# EAGLE design smart_lamp (EAGLE 9.6.2)
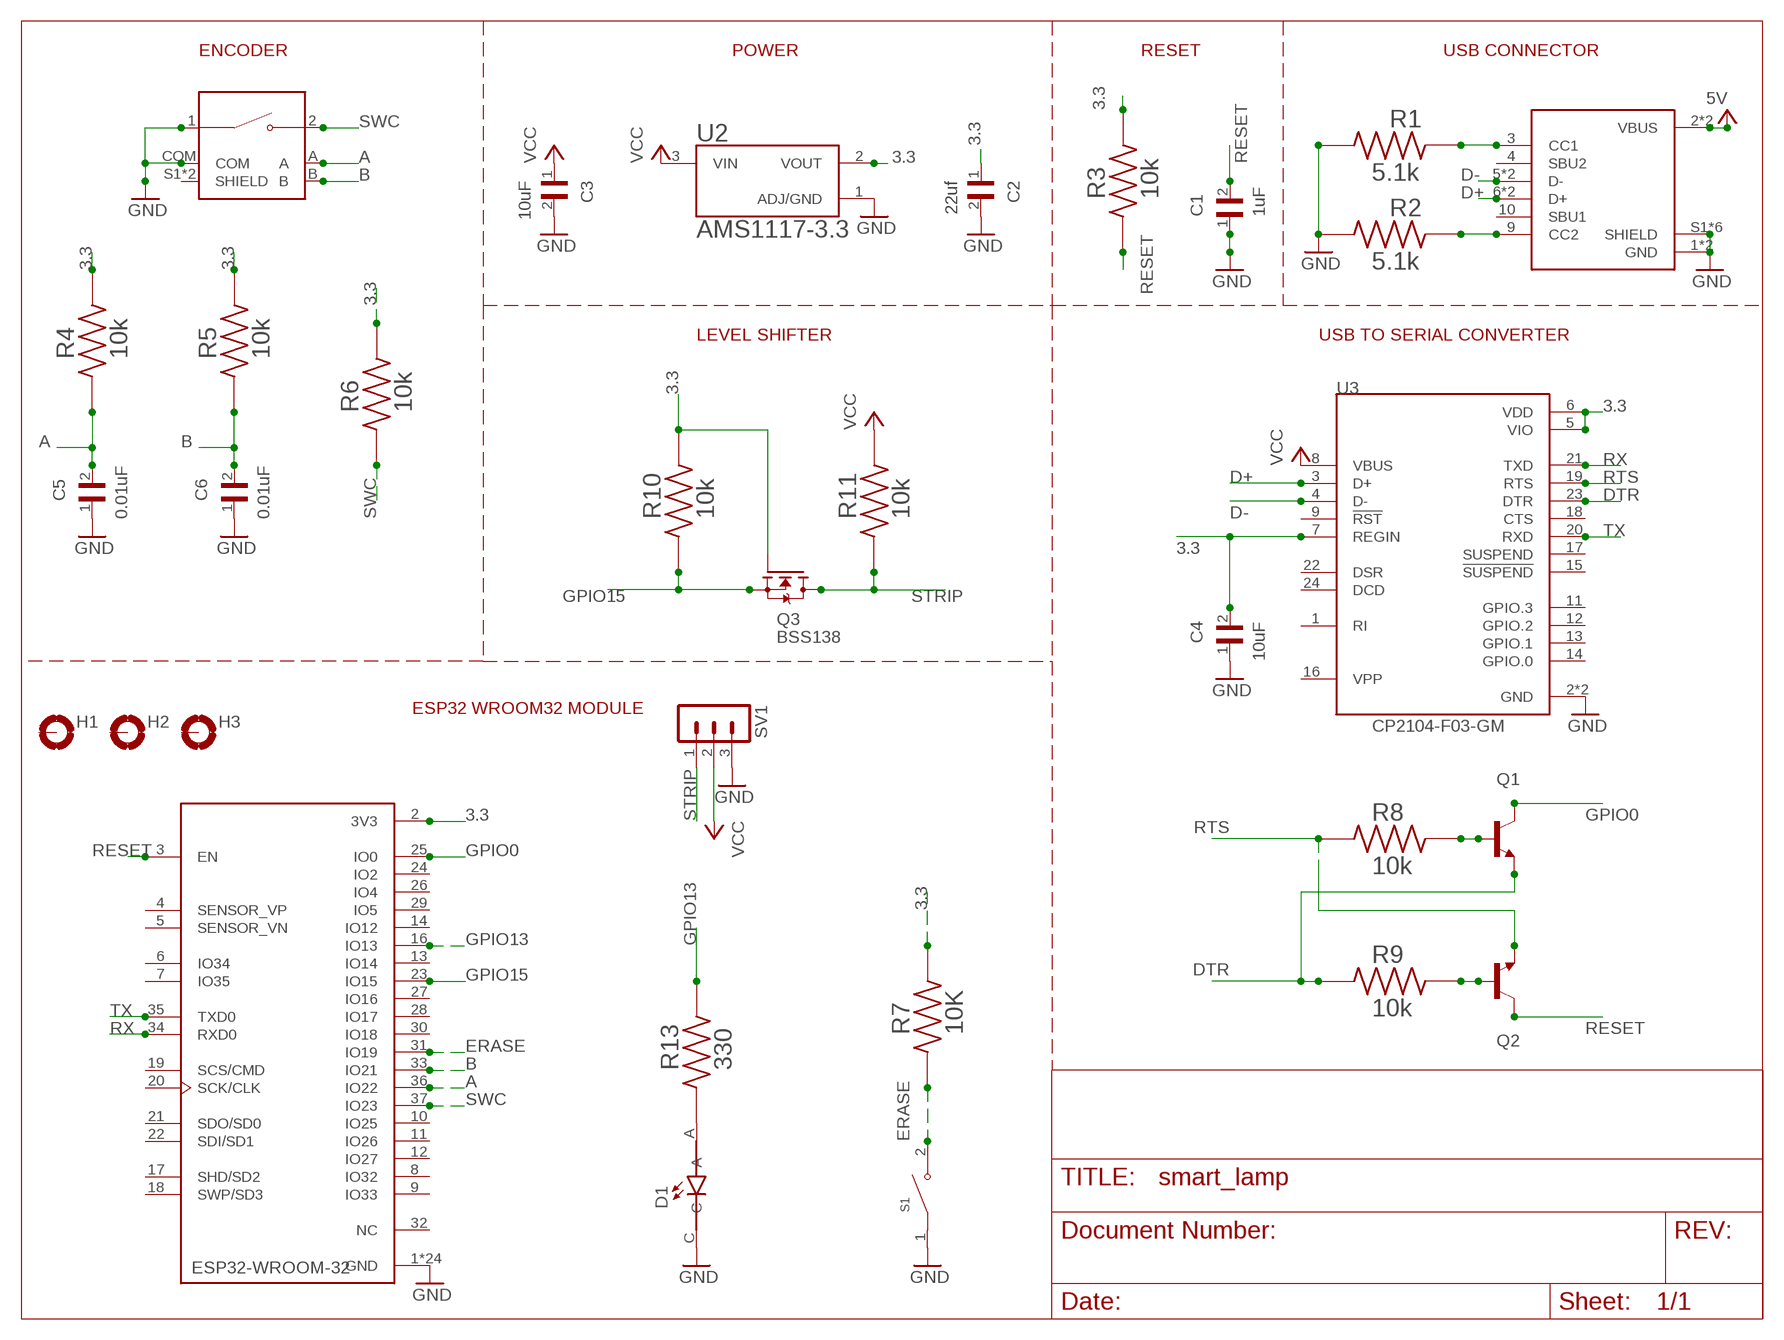
[diagram p0: schematic, sheet 1]

## Parts
C1  1uF  0805YC103J4T2A  [CAPC2012X94N]
C2  22uf  0805YC103J4T2A  [CAPC2012X94N]
C3  10uF  0805YC103J4T2A  [CAPC2012X94N]
C4  10uF  0805YC103J4T2A  [CAPC2012X94N]
C5  0.01uF  0805YC103J4T2A  [CAPC2012X94N]
C6  0.01uF  0805YC103J4T2A  [CAPC2012X94N]
D1  SML-LXT0805IW-TR  [LEDC2012X120N]
H1  MOUNT-PAD-ROUND3.2  [3,2-PAD]
H2  MOUNT-PAD-ROUND3.2  [3,2-PAD]
H3  MOUNT-PAD-ROUND3.2  [3,2-PAD]
J1  DX07S016JA1R1500  [JAE_DX07S016JA1R1500]
MT1  PEC11R-4215F-S0024  [XDCR_PEC11R-4215F-S0024]
Q1  MMBT2222  [SOT23-BEC]
Q2  MMBT2222  [SOT23-BEC]
Q3  BSS138  [SOT95P240X111-3N]
R1  5.1k  RC0805FR-07330RL  [RESC2012X60N]
R2  5.1k  RC0805FR-07330RL  [RESC2012X60N]
R3  10k  RC0805FR-07330RL  [RESC2012X60N]
R4  10k  RC0805FR-07330RL  [RESC2012X60N]
R5  10k  RC0805FR-07330RL  [RESC2012X60N]
R6  10k  RC0805FR-07330RL  [RESC2012X60N]
R7  10K  RC0805FR-07330RL  [RESC2012X60N]
R8  10k  RC0805FR-07330RL  [RESC2012X60N]
R9  10k  RC0805FR-07330RL  [RESC2012X60N]
R10  10k  RC0805FR-07330RL  [RESC2012X60N]
R11  10k  RC0805FR-07330RL  [RESC2012X60N]
R13  330  RC0805FR-07330RL  [RESC2012X60N]
S1  PTS636_SM43J_SMTR_LFS  [SW_PTS636_SM43J_SMTR_LFS]
SV1  MA03-1  [MA03-1]
U1  ESP32-WROOM-32  [MODULE_ESP32-WROOM-32]
U2  AMS1117-3.3  [SOT229P700X180-4N]
U3  CP2104-F03-GM  [QFN50P400X400X80-25N]

## Nets
3.3: C2.1 C4.2 Q3.1(G) R3.2 R4.2 R5.2 R6.2 R7.2 R10.2 U1.2(3V3) U2.2(VOUT) U3.5(VIO) U3.6(VDD) U3.7(REGIN)
A: C5.2 MT1.A R4.1 U1.36(IO22)
B: C6.2 MT1.B R5.1 U1.33(IO21)
D+: J1.6(D+) J1.7(D+) U3.3(D+)
D-: J1.5(D-) J1.8(D-) U3.4(D-)
DTR: Q1.E R9.1 U3.23(DTR)
ERASE: R7.1 S1.2(NO) U1.31(IO19)
GND: C1.1 C2.2 C3.2 C4.1 C5.1 C6.1 D1.C J1.1(GND) J1.12(GND) J1.S1(SHIELD) J1.S2(SHIELD) J1.S3(SHIELD) J1.S4(SHIELD) J1.S5(SHIELD) J1.S6(SHIELD) MT1.1 MT1.COM R1.1 R2.1 S1.1(COM) SV1.3 U1.1(GND) U1.15(GND) U1.38(GND) U1.39_1(GND) U1.39_2(GND) U1.39_3(GND) U1.39_4(GND) U1.39_5(GND) U1.39_6(GND) U1.39_7(GND) U1.39_8(GND) U1.39_9(GND) U1.39_10(GND) U1.39_11(GND) U1.39_12(GND) U1.39_13(GND) U1.39_14(GND) U1.39_15(GND) U1.39_16(GND) U1.39_17(GND) U1.39_18(GND) U1.39_19(GND) U1.39_20(GND) U1.39_21(GND) U2.1(ADJ/GND) U3.2(GND) U3.25(GND)
GPIO0: Q1.C U1.25(IO0)
GPIO13: R13.2 U1.16(IO13)
GPIO15: Q3.2(S) R10.1 U1.23(IO15)
N$1: J1.3(CC1) R1.2
N$2: J1.9(CC2) R2.2
N$3: Q1.B R8.2
N$4: Q2.B R9.2
N$5: D1.A R13.1
RESET: C1.2 Q2.C R3.1 U1.3(EN)
RTS: Q2.E R8.1 U3.19(RTS)
RX: U1.34(RXD0) U3.21(TXD)
STRIP: Q3.3(D) R11.1 SV1.1
SWC: MT1.2 R6.1 U1.37(IO23)
TX: U1.35(TXD0) U3.20(RXD)
VCC: C3.1 J1.2(VBUS) J1.11(VBUS) R11.2 SV1.2 U2.3(VIN) U3.8(VBUS) ; supply symbol labelled 5V
Unconnected: H1.B3,2(MOUNT) H2.B3,2(MOUNT) H3.B3,2(MOUNT) J1.4(SBU2) J1.10(SBU1) MT1.S1(SHIELD) MT1.S2(SHIELD) U1.4(SENSOR_VP) U1.5(SENSOR_VN) U1.6(IO34) U1.7(IO35) U1.8(IO32) U1.9(IO33) U1.10(IO25) U1.11(IO26) U1.12(IO27) U1.13(IO14) U1.14(IO12) U1.17(SHD/SD2) U1.18(SWP/SD3) U1.19(SCS/CMD) U1.20(SCK/CLK) U1.21(SDO/SD0) U1.22(SDI/SD1) U1.24(IO2) U1.26(IO4) U1.27(IO16) U1.28(IO17) U1.29(IO5) U1.30(IO18) U1.32(NC) U3.1(RI) U3.9(!RST) U3.11(GPIO.3) U3.12(GPIO.2) U3.13(GPIO.1) U3.14(GPIO.0) U3.15(!SUSPEND) U3.16(VPP) U3.17(SUSPEND) U3.18(CTS) U3.22(DSR) U3.24(DCD)

## Notes on the sheet
- ENCODER | POWER | RESET | USB CONNECTOR
- LEVEL SHIFTER | USB TO SERIAL CONVERTER
- ESP32 WROOM32 MODULE

## Library data of the parts
C1-C6 = 0805YC103J4T2A:0805YC103J4T2A: Cap Ceramic 0.01uF 16V X7R 5% SMD 0805 125°C Paper T/R Check availability <https://pricing.snapeda.com/parts/0805YC103J4T2A/AVX/view-part?ref=eda>; AVAILABILITY: In Stock; DESCRIPTION: 10000 pF ±5% 16V Ceramic Capacitor X7R 0805 (2012 Metric); MF: AVX; MP: 0805YC103J4T2A; PACKAGE: 2012 AVX; PRICE: None; PURCHASE-URL: https://pricing.snapeda.com/search/part/0805YC103J4T2A/?ref=eda
D1 = SML-LXT0805IW-TR:SML-LXT0805IW-TR: LED; Luminous Intensity:11µcd; Viewing Angle:140°; Forward Current:30mA; Forward Voltage:2V; Color:Red; LED Color:Red; Leaded Process Compatible:Yes; Lens Color:White; Mounting Type:Surface Mount ;RoHS Compliant: Yes Check availability <https://pricing.snapeda.com/parts/SML-LXT0805IW-TR/Lumex%20Opto/Components/view-part?ref=eda>; AVAILABILITY: In Stock; DESCRIPTION: Red - LED Indication - Discrete 2V 0805 (2012 Metric); MF: Lumex Opto/Components; MP: SML-LXT0805IW-TR; PACKAGE: 0805 Lumex; PRICE: None; PURCHASE-URL: https://pricing.snapeda.com/search/part/SML-LXT0805IW-TR/?ref=eda
H1-H3 = holes:MOUNT-PAD-ROUND: MOUNTING PAD, round
J1 = DX07S016JA1R1500:DX07S016JA1R1500: USB-C (USB TYPE-C) USB 2.0 Receptacle Connector 24 (16+8 Dummy) Position Surface Mount, Right Angle; Through Hole Check availability <https://pricing.snapeda.com/parts/DX07S016JA1R1500/JAE%20Electronics/view-part?ref=eda>; AVAILABILITY: In Stock; DESCRIPTION: USB-C (USB TYPE-C) USB 2.0 Receptacle Connector 24 (16+8 Dummy) Position Surface Mount, Right Angle; Through Hole; MF: JAE Electronics; MP: DX07S016JA1R1500; PACKAGE: None; PRICE: None; PURCHASE-URL: https://pricing.snapeda.com/search/part/DX07S016JA1R1500/?ref=eda
MT1 = PEC11R-4215F-S0024:PEC11R-4215F-S0024: Incremental Encoder, 12 Mm, Contact Rating 10 Ma - 5 Vdc Check availability <https://pricing.snapeda.com/parts/PEC11R-4215F-S0024/Bourns/view-part?ref=eda>; AVAILABILITY: In Stock; DESCRIPTION: Rotary Encoder Mechanical 24 Quadrature (Incremental) Vertical; MF: Bourns; MP: PEC11R-4215F-S0024; PACKAGE: None; PRICE: None; PURCHASE-URL: https://pricing.snapeda.com/search/part/PEC11R-4215F-S0024/?ref=eda
Q1 Q2 = MMBT2222_:MMBT2222*: NPN Transistor Check availability <https://pricing.snapeda.com/parts/MMBT2222/ON%20Semiconductor/view-part?ref=eda>; AVAILABILITY: In Stock; DESCRIPTION: Bipolar (BJT) Transistor NPN 30 V 600 mA 250MHz 300 mW Surface Mount SOT-23-3 (TO-236); MF: ON Semiconductor; MP: MMBT2222; PACKAGE: SOT-23-3 Fairchild Semiconductor; PRICE: None; PURCHASE-URL: https://pricing.snapeda.com/search/part/MMBT2222/?ref=eda
Q3 = BSS138:BSS138: N-Channel 50V 220mA (Ta) 360mW (Ta) Surface Mount SOT-23-3 Check availability <https://pricing.snapeda.com/parts/BSS138/ON%20Semiconductor/view-part?ref=eda>; AVAILABILITY: In Stock; DESCRIPTION: N-Channel 50 V 200mA (Ta) 225mW (Ta) Surface Mount SOT-23-3 (TO-236); MF: ON Semiconductor; MP: BSS138; PACKAGE: SOT-23 ON; PRICE: None; PURCHASE-URL: https://pricing.snapeda.com/search/part/BSS138/?ref=eda
R1-R11 R13 = RC0805FR-07330RL:RC0805FR-07330RL: Resistor SMD [YAGEO] RC0805FR-07330RL Resistor SMD Check availability <https://pricing.snapeda.com/parts/RC0805FR-07330RL/Yageo/view-part?ref=eda>; AVAILABILITY: In Stock; DESCRIPTION: 330 Ohms ±1% 0.125W, 1/8W Chip Resistor 0805 (2012 Metric) Moisture Resistant Thick Film; MF: Yageo; MP: RC0805FR-07330RL; PACKAGE: 2012 Rohm Semiconductor; PRICE: None; PURCHASE-URL: https://pricing.snapeda.com/search/part/RC0805FR-07330RL/?ref=eda
S1 = PTS636_SM43J_SMTR_LFS:PTS636_SM43J_SMTR_LFS: Tactile Switch SPST-NO Top Actuated Surface Mount Check availability <https://pricing.snapeda.com/parts/PTS636%20SM43J%20SMTR%20LFS/C%26K/view-part?ref=eda>; AVAILABILITY: In Stock; DESCRIPTION: Tactile Switch SPST-NO Top Actuated Surface Mount; MF: C&K; MP: PTS636 SM43J SMTR LFS; PACKAGE: None; PRICE: None; PURCHASE-URL: https://pricing.snapeda.com/search/part/PTS636 SM43J SMTR LFS/?ref=eda
SV1 = con-lstb:MA03-1: PIN HEADER; OC_FARNELL: unknown; OC_NEWARK: unknown
U1 = ESP32-WROOM-32:ESP32-WROOM-32: Check availability <https://pricing.snapeda.com/parts/ESP32-WROOM-32/Espressif%20Systems/view-part?ref=eda>; AVAILABILITY: In Stock; DESCRIPTION: Bluetooth, WiFi 802.11b/g/n, Bluetooth v4.2 +EDR, Class 1, 2 and 3 Transceiver Module 2.4GHz ~ 2.5GHz Antenna Not Included, U.FL Surface Mount; MF: Espressif Systems; MP: ESP32-WROOM-32; PACKAGE: Module Espressif Systems; PRICE: None; PURCHASE-URL: https://pricing.snapeda.com/search/part/ESP32-WROOM-32/?ref=eda
U2 = AMS1117-3.3:AMS1117-3.3: Sot223/Pkg 1-Amp 3.3-Volt Low Drop Out Voltage Regulatator Check availability <https://pricing.snapeda.com/parts/AMS1117-3.3/Advanced%20Monolithic%20Systems/view-part?ref=eda>; AVAILABILITY: Not in stock; DESCRIPTION: LDO Voltage Regulators 800MA LDO LINEAR REG; MF: Advanced Monolithic Systems; MP: AMS1117-3.3; PACKAGE: SOT-223 Seeed Technology; PRICE: None
U3 = CP2104-F03-GM:CP2104-F03-GM: USB-to-UART 1-CH 576byte FIFO 3.3V 24-Pin QFN EP T/R Check availability <https://pricing.snapeda.com/parts/CP2104-F03-GM/Silicon%20Labs/view-part?ref=eda>; AVAILABILITY: In Stock; DESCRIPTION: USB Bridge, USB to UART USB 2.0 UART Interface 24-QFN (4x4); MF: Silicon Labs; MP: CP2104-F03-GM; PACKAGE: WFQFN-24 Silicon Labs; PRICE: None; PURCHASE-URL: https://pricing.snapeda.com/search/part/CP2104-F03-GM/?ref=eda

## Board
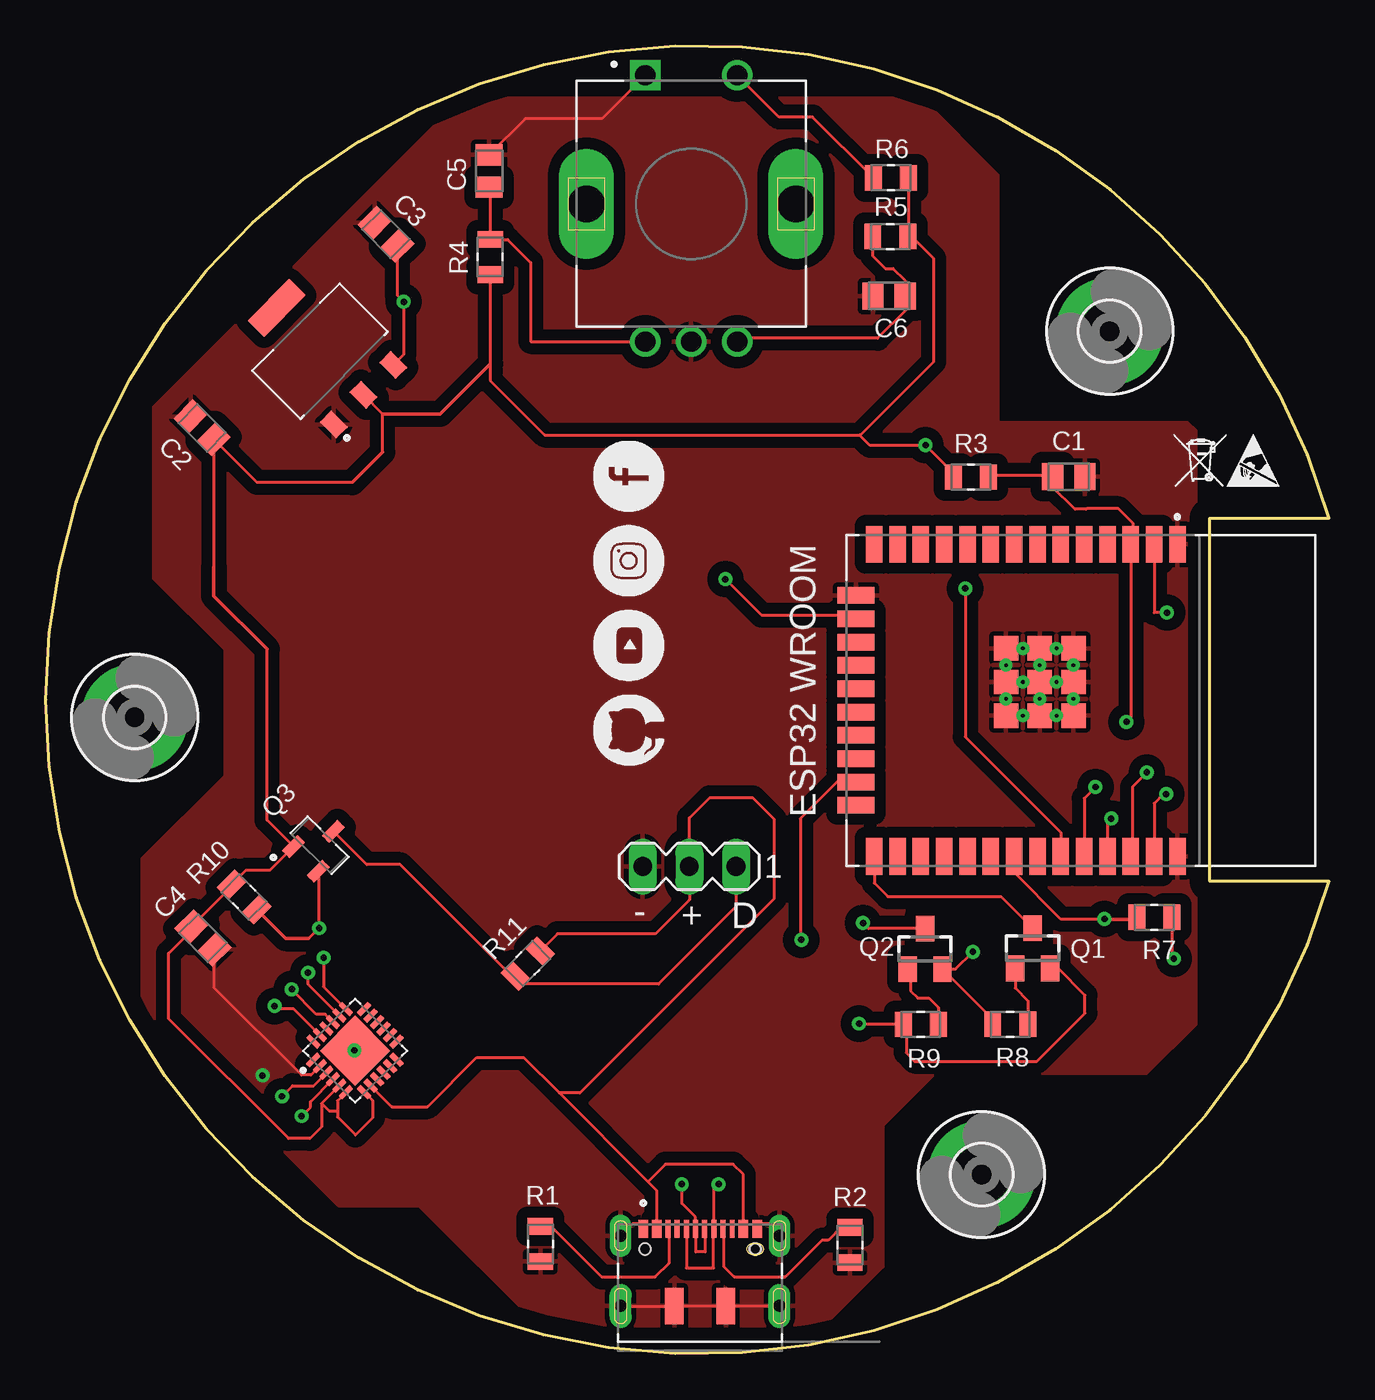
[diagram p1: board, top side]
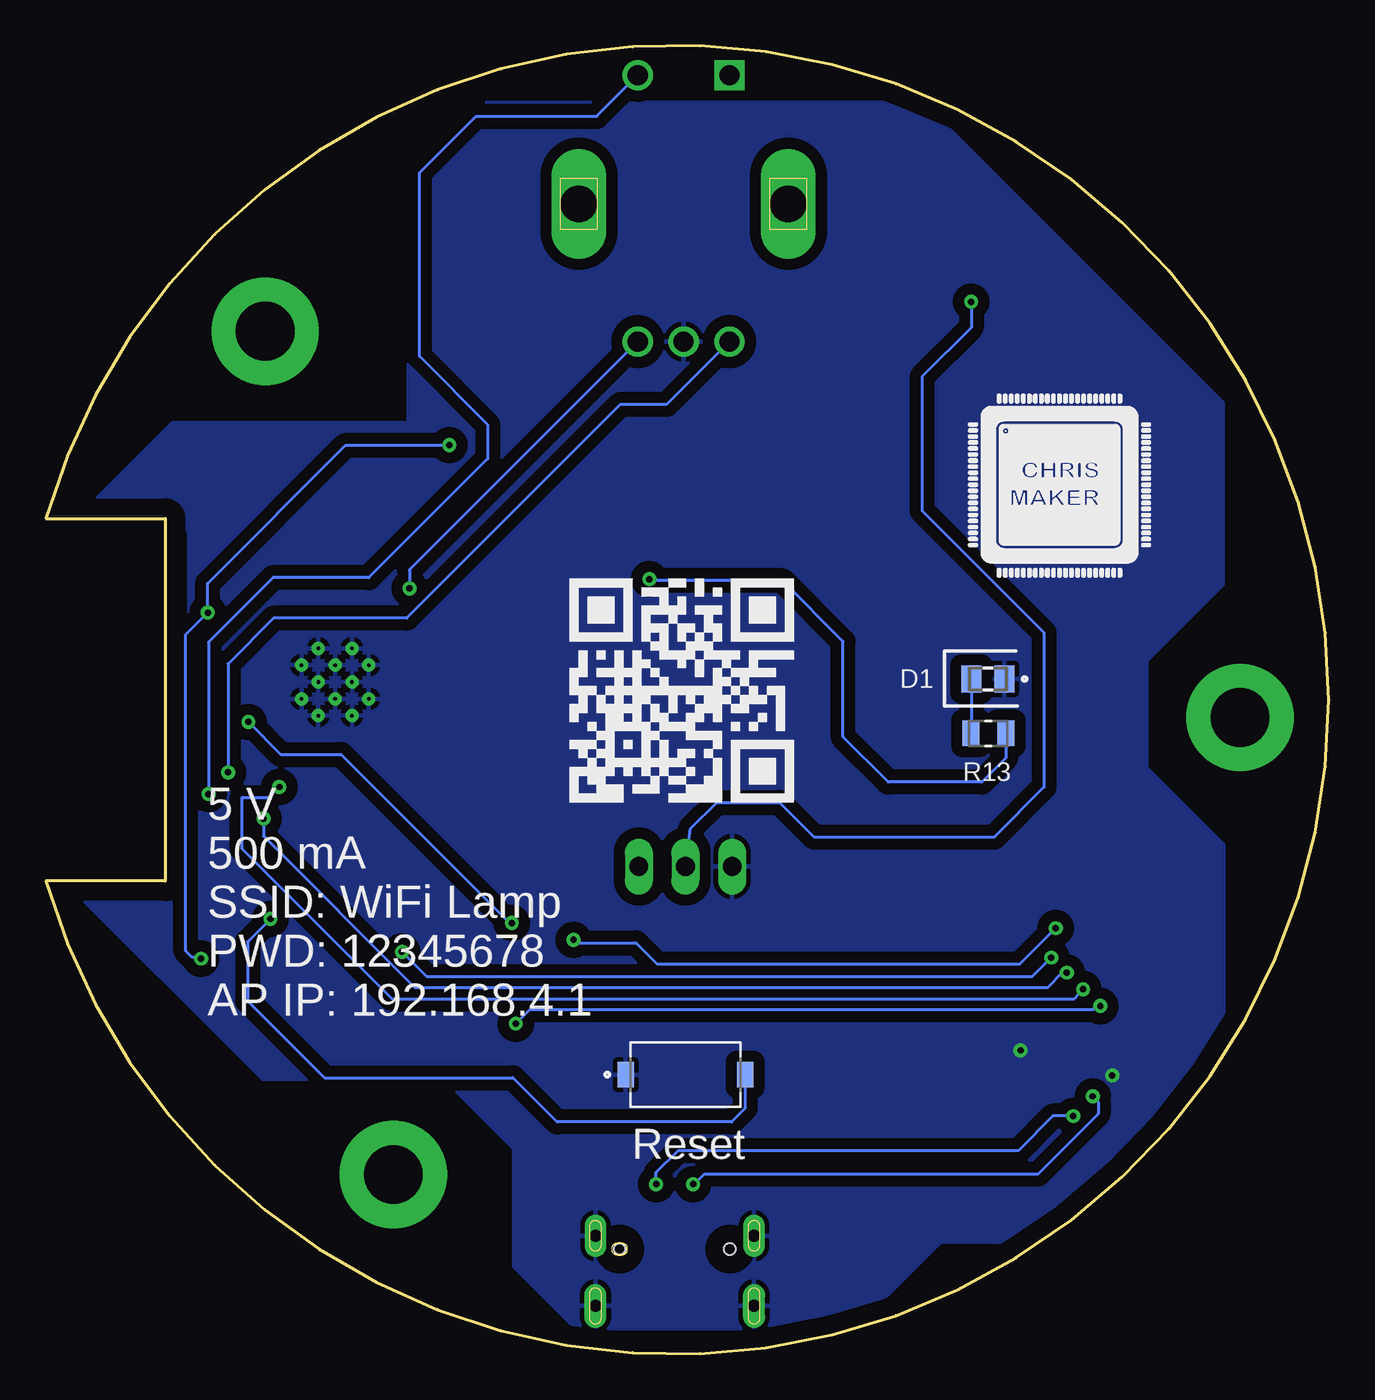
[diagram p2: board, bottom side, seen from below]

Size 69.85 x 71.19 mm. Coordinates in mm from the lower left corner, seen from the top.
Outline: 69.85,25.73 arc-328 69.85,45.46 63.34,45.46 63.34,25.73 69.85,25.73
Copper layers (1*16): Top 0.035mm / dielectric 1.5mm / Bottom 0.035mm
Design rules "default": minimum track width 6mil, minimum drill 0.35mm, track to track 6mil, track to pad 6mil, pad to pad 6mil, via to via 6mil, smd to smd 6mil, copper to edge 40mil, drill to drill 6mil, minimum pad ring 10mil, minimum via ring 8mil, stop-mask expansion 4mil, vias tented up to drill 0mil, thermal gap 10mil

### Footprints (pad centres in the part's own frame; a part is rotated, then mirrored left to right if it is on the bottom)
CAPC2012X94N = smd 1.16 x 1.47: 1 -0.88,0; 2 0.88,0
LEDC2012X120N = smd 1.1 x 1.45: A 0.9,0; C -0.9,0
3,2-PAD = drill 3.2 pad 5.842: B3,2 0,0
JAE_DX07S016JA1R1500 = smd 0.52 x 1: 1 -3.1,1.1; 2 -2.35,1.1; 11 2.35,1.1; 12 3.1,1.1 | smd 0.27 x 1: 3 -1.75,1.1; 4 -1.25,1.1; 5 -0.75,1.1; 6 -0.25,1.1; 7 0.25,1.1; 8 0.75,1.1; 9 1.25,1.1; 10 1.75,1.1 | smd 1 x 2: S1 -1.4,-3.1; S2 1.4,-3.1 | drill 0.65 long: S3 -4.32,0.725; S4 4.32,0.725 | drill 0.65 pad 1.2 long: S5 -4.32,-3.1; S6 4.32,-3.1 | hole 0.6: 3,0 | hole 0.63: 3,0; -3,0
XDCR_PEC11R-4215F-S0024 = drill 1.1 square: 1 -2.5,7 | drill 1.1: 2 2.5,7; A -2.5,-7.5; B 2.5,-7.5; COM 0,-7.5 | drill 2 long: S1 -5.7,0; S2 5.7,0
SOT23-BEC = smd 1 x 1.4: B -0.95,-1.1; C 0,1.1; E 0.95,-1.1
SOT95P240X111-3N = smd 1.23 x 0.6: 1 -1.06,0.95; 2 -1.06,-0.95; 3 1.06,0
RESC2012X60N = smd 0.92 x 1.38: 1 -0.955,0; 2 0.955,0
SW_PTS636_SM43J_SMTR_LFS = smd 0.9 x 1.4: 1 -3.25,0; 2 3.25,0
MA03-1 = drill 1.016 long: 1 -2.54,0; 2 0,0; 3 2.54,0
MODULE_ESP32-WROOM-32 = smd 2 x 0.9: 1 -8.5,5.26; 2 -8.5,3.99; 3 -8.5,2.72; 4 -8.5,1.45; 5 -8.5,0.18; 6 -8.5,-1.09; 7 -8.5,-2.36; 8 -8.5,-3.63; 9 -8.5,-4.9; 10 -8.5,-6.17; 11 -8.5,-7.44; 12 -8.5,-8.71; 13 -8.5,-9.98; 14 -8.5,-11.25; 25 8.5,-11.25; 26 8.5,-9.98; 27 8.5,-8.71; 28 8.5,-7.44; 29 8.5,-6.17; 30 8.5,-4.9; 31 8.5,-3.63; 32 8.5,-2.36; 33 8.5,-1.09; 34 8.5,0.18; 35 8.5,1.45; 36 8.5,2.72; 37 8.5,3.99; 38 8.5,5.26 | smd 0.9 x 2: 15 -5.715,-12.25; 16 -4.445,-12.25; 17 -3.175,-12.25; 18 -1.905,-12.25; 19 -0.635,-12.25; 20 0.635,-12.25; 21 1.905,-12.25; 22 3.175,-12.25; 23 4.445,-12.25; 24 5.715,-12.25 | smd 1.33 x 1.33: 39_1 -2.835,-0.405; 39_2 -1,-0.405; 39_3 0.835,-0.405; 39_4 -2.835,-2.24; 39_5 -1,-2.24; 39_6 0.835,-2.24; 39_7 -2.835,-4.075; 39_8 -1,-4.075; 39_9 0.835,-4.075 | drill 0.2 pad 0.3: 39_10 -1.917,-0.405; 39_11 -0.083,-0.405; 39_12 -2.835,-1.323; 39_13 -1,-1.323; 39_14 0.835,-1.323; 39_15 -1.917,-2.24; 39_16 -0.083,-2.24; 39_17 -2.835,-3.158; 39_18 -1,-3.158; 39_19 0.835,-3.158; 39_20 -1.917,-4.075; 39_21 -0.083,-4.075
SOT229P700X180-4N = smd 0.93 x 1.31: 1 -2.29,-3.345; 2 0,-3.345; 3 2.29,-3.345 | smd 3.24 x 1.31: 4 0,3.345
QFN50P400X400X80-25N = smd 0.84 x 0.26: 1 -1.97,1.25 | smd 0.82 x 0.26: 2 -1.955,0.75; 3 -1.955,0.25; 4 -1.955,-0.25; 5 -1.955,-0.75; 6 -1.955,-1.25; 13 1.955,-1.25; 14 1.955,-0.75; 15 1.955,-0.25; 16 1.955,0.25; 17 1.955,0.75; 18 1.955,1.25 | smd 0.26 x 0.82: 7 -1.25,-1.955; 8 -0.75,-1.955; 9 -0.25,-1.955; 10 0.25,-1.955; 11 0.75,-1.955; 12 1.25,-1.955; 19 1.25,1.955; 20 0.75,1.955; 21 0.25,1.955; 22 -0.25,1.955; 23 -0.75,1.955; 24 -1.25,1.955 | smd 2.7 x 2.7: 25 0,0

### Placement (x,y rotation side)
C1  55.68,47.74 180 top
C2  8.51,50.4 135 top
C3  18.51,60.93 135 top
C4  8.55,22.62 135 top
C5  24.14,64.38 270 top
C6  45.9,57.58 0 top
D1  18.56,36.72 180 bottom
H1  50.94,9.74 0 top
H2  4.83,34.63 0 top
H3  57.91,55.66 0 top
J1  35.61,5.69 0 top
MT1  35.13,62.59 0 top
Q1  53.71,22.07 0 top
Q2  47.86,22.03 0 top
Q3  14.9,27.68 45 top
R1  26.92,5.97 90 top
R2  43.77,5.91 90 top
R3  50.35,47.72 180 top
R4  24.19,59.7 270 top
R5  45.96,60.81 0 top
R6  46,64.01 0 top
R7  60.34,23.75 0 top
R8  52.49,17.93 0 top
R9  47.63,17.92 0 top
R10  10.79,24.86 135 top
R11  26.23,21.23 45 top
R13  18.54,33.77 0 bottom
S1  35.03,15.18 0 bottom
SV1  35.03,26.52 180 top
U1  56.34,35.56 270 top
U2  14.92,54.56 45 top
U3  16.83,16.49 45 top

### Tracks (layer width: path | path; a pad name or v marks a point on that pad's centre or on a via)
3.3  (via drill 0.35)
  Top 0.152: R6.2 46.96,61.24 47.15,61.05 47.03,60.92 | 47.03,60.92 R5.2 | R4.2 24.19,53.88 24.19,52.97 27.16,50.01 44.29,50.01 | 16.69,47.44 11.48,47.44 C2.1 9.13,42.81 | U1.2 60.33,40.34 v61.03,40.34 | R3.2 49.4,47.94 v47.88,49.46 47.86,49.43 44.87,49.43 44.29,50.01 | R7.2 61.3,21.61 v61.4,21.5 | 18.32,49.07 18.32,51.16 U2.2 | 44.29,50.01 44.34,50.01 48.33,54 48.33,59.61 47.03,60.92 | U3.7 17.78,13.77 17.78,12.82 16.85,11.9 15.87,12.88 15.87,13.2 | 15.87,13.2 15.87,13.77 U3.6 | 12.04,38.35 12.04,29.05 Q3.1 12.2,26.32 10.9,26.32 R10.2 10.11,25.43 C4.2 7.93,23.04 6.68,21.79 6.68,18.23 13.2,11.71 14.37,11.71 15.01,12.34 15.01,13.61 | U3.5 15.01,13.61 | 15.01,13.61 15.42,13.2 15.87,13.2
  Top 0.2: 16.69,47.44 18.32,49.07 | 18.32,51.16 21.47,51.16 24.19,53.88 | 9.13,42.81 9.13,41.25 12.04,38.35
  Bottom 0.152: v47.88,49.46 53.52,49.46 61.05,41.93 61.03,41.92 v61.03,40.34 62.23,39.15 62.23,21.93 61.87,21.57 61.48,21.57 v61.4,21.5
A  (via drill 0.35)
  Top 0.152: C5.2 24.19,63.44 R4.1 25.14,60.65 26.4,59.4 26.4,55.09 MT1.A | U1.36 59.15,27.06 59.15,30.85 v59.94,31.64
  Bottom 0.152: MT1.A 36.05,51.68 38.55,51.68 50.2,40.03 57.45,40.03 59.94,37.55 v59.94,31.64
B  (via drill 0.35)
  Top 0.152: MT1.B 37.82,55.28 45.27,55.28 46.78,56.79 C6.2 46.78,58.41 46.12,59.07 45.69,59.07 45.01,59.76 R5.1 | U1.33 55.25,28.37 50.05,33.58 v50.05,41.65
  Bottom 0.152: MT1.B 50.05,42.68 v50.05,41.65
D+  (via drill 0.35)
  Top 0.152: U3.3 15.19,15.29 15.19,15.19 14.58,14.58 13.43,14.58 v12.85,14 | v34.62,9.22 34.62,8.18 35.35,7.44 35.35,6.8 J1.6 35.36,5.55 35.38,5.53 35.89,5.53 35.89,6.77 J1.7
  Bottom 0.152: v12.85,14 12.56,13.71 12.56,13.06 15.83,9.79 33.99,9.79 34.56,9.22 v34.62,9.22
D-  (via drill 0.35)
  Top 0.152: v13.92,12.93 14.4,13.41 14.4,13.71 U3.4 | U3.4 | v36.62,9.22 36.36,8.96 J1.8 36.35,6.78 36.35,4.67 34.87,4.67 34.87,6.78 J1.5
  Bottom 0.152: v13.92,12.93 15.02,12.93 16.89,11.06 35.42,11.06 36.62,9.86 v36.62,9.22
DTR  (via drill 0.35)
  Top 0.152: Q1.E 55.11,20.97 56.56,19.51 56.56,18.52 53.95,15.91 47.29,15.91 46.83,16.37 46.83,17.76 R9.1 44.31,17.92 v44.26,17.96 | U3.23 13.49,18.76 12.62,18.76 v12.44,18.92
  Bottom 0.152: v12.44,18.92 12.85,18.75 43.48,18.75 v44.26,17.96
ERASE  (via drill 0.35)
  Top 0.152: U1.31 52.71,26.19 55.26,23.64 59.28,23.64 R7.1 59.25,23.61 57.57,23.61 v57.62,23.66
  Bottom 0.152: S1.2 31.78,13.35 32.52,12.62 42.02,12.62 44.42,15.02 54.68,15.02 58.87,19.2 58.87,22.42 v57.62,23.66
GND  (via drill 0.35)
  Top 0.152: U3.25 16.82,16.48 v16.79,16.51 | J1.S6 39.93,2.52 39.86,2.59 J1.S2 36.98,2.56 34.18,2.56 31.32,2.56 J1.S5 | J1.1 32.25,7.05 31.93,7.05 J1.S3 | J1.12 38.61,6.89 38.74,7.02 38.74,7.07 39.48,7.07 39.93,6.62 J1.S4 | MT1.1 30.27,67.23 26.11,67.23 C5.1 | U3.2 14.43,15.16 13.92,15.16 9.17,19.91 C4.1
  Top 0.2: 34.18,2.56 J1.S1
  other vias: 11.79,15.14
  pour Top (isolate 0.61): 9.75,38.31 5.88,42.18 5.88,51.57 22.67,68.36 47.65,68.36 51.82,64.19 51.82,50.7 62.15,50.7 62.59,50.27 62.59,17.91 59.91,15.23 48.39,15.23 45.57,12.41 45.57,4.71 42.34,1.48 26.87,1.48 20.32,8.03 15.94,8.03 5.24,18.72 5.24,26.98 9.75,31.49
  pour Bottom (isolate 0.61): 5.72,51.77 22.09,68.14 45.87,68.14 50.16,63.85 50.16,50.7 62.99,50.7 69.18,44.51 69.18,26.02 58.09,14.93 48.19,14.93 44.41,11.15 44.41,4.73 41.04,1.36 25.81,1.36 21.11,6.06 15.39,6.06 5.69,15.76 5.69,27.71 9.9,31.92 9.9,37.71 5.72,41.88
GPIO0
  Top 0.152: Q1.C 52,24.88 45.83,24.88 45.09,25.62 U1.25
GPIO13  (via drill 0.35)
  Top 0.152: U1.16 43.91,40.18 38.97,40.18 v36.99,42.16
  Bottom 0.152: R13.2 17.59,32.43 18.9,31.12 23.99,31.12 26.45,33.58 26.45,38.77 29.76,42.08 36.99,42.08 v36.99,42.16
GPIO15  (via drill 0.35)
  Top 0.152: v41.12,22.52 41.07,22.57 41.07,29.13 43.06,31.12 U1.23 | 14.32,22.6 v14.87,23.16 14.87,26.21 Q3.2
  Top 0.2: R10.1 13.04,22.6 14.32,22.6
  Bottom 0.152: v41.12,22.52 40.97,22.37 37.73,22.37 36.55,21.2 16.84,21.2 v14.87,23.16
N$1
  Top 0.152: R1.2 27.5,6.92 30.25,4.17 33.16,4.17 33.91,4.92 33.91,6.5 33.86,6.55 J1.3
N$2
  Top 0.152: R2.2 43.29,6.87 42.6,6.17 42.25,6.17 40.26,4.18 37.46,4.18 36.9,4.75 36.9,6.76 J1.9
N$3
  Top 0.152: Q1.B 52.76,19.9 53.44,19.22 53.45,19.22 R8.2
N$4
  Top 0.152: Q2.B 47.06,20.78 47.06,19.76 47.46,19.36 48.07,19.36 48.58,18.84 R9.2
N$5
  Bottom 0.152: D1.A 19.46,33.8 R13.1
RESET  (via drill 0.35)
  Top 0.152: R3.1 51.39,47.79 54.9,47.79 C1.2 54.8,47.18 56.02,45.96 56.64,45.96 56.66,45.99 58.39,45.99 59.16,45.22 59.16,44.16 U1.3 59.06,34.63 v58.82,34.39 | Q2.C 44.79,23.13 v44.48,23.44
  Bottom 0.152: v44.48,23.44 44.6,23.44 53.78,32.63 57.08,32.63 58.82,34.37 v58.82,34.39
RTS  (via drill 0.35)
  Top 0.152: R8.1 51.54,18.2 Q2.E 49.52,20.93 v50.46,21.87 | U3.19 15.12,19.97 v15.12,21.55
  Bottom 0.152: v50.46,21.87 49.13,20.54 16.14,20.54 v15.12,21.55
RX  (via drill 0.35)
  Top 0.152: U3.21 15.21,18.47 14.72,18.47 v13.39,19.84 v13.38,19.83 | v57.14,30.85 56.52,30.23 U1.34
  Bottom 0.152: v13.38,19.83 13.87,19.32 51,19.32 59.15,27.46 59.15,30.28 57.71,30.28 v57.14,30.85
STRIP
  Top 0.152: Q3.3 17.46,26.62 19.28,26.62 25.35,20.56 R11.1 25.99,20.13 33.36,20.13 37.57,24.33 SV1.1
SWC  (via drill 0.35)
  Top 0.152: R6.1 41.74,67.32 39.91,67.32 MT1.2 | v60.99,30.46 60.84,30.46 60.33,29.96 U1.37
  Bottom 0.152: MT1.2 39.87,67.36 46.43,67.36 49.52,64.28 49.52,54.29 45.79,50.57 45.79,48.71 52.27,42.24 57.48,42.24 60.99,38.72 v60.99,30.46
TX  (via drill 0.35)
  Top 0.152: U3.20 14.27,20.11 v14.27,20.74 | v58,29.13 57.79,28.92 U1.35
  Bottom 0.152: v14.27,20.74 14.5,20.74 15.3,19.94 49.77,19.94 58,28.17 v58,29.13
VCC  (via drill 0.35)
  Top 0.152: U2.3 19.48,54.39 v19.48,57.27 19.13,57.61 C3.1 | U3.8 18.82,13.44 20.77,13.44 23.45,16.12 26.01,16.12 27.95,14.18 | R11.2 27.85,22.85 33.18,22.85 35.03,24.7 SV1.2 35.03,29.16 36.14,30.27 38.48,30.27 39.65,29.1 39.65,24.76 29.07,14.18 27.95,14.18 | J1.2 33.26,8.87 32.78,9.36 | 32.78,9.36 27.95,14.18 | 32.78,9.36 33.73,10.31 37.41,10.31 37.96,9.76 J1.11
  Bottom 0.152: v19.48,57.27 19.48,55.86 22.15,53.19 22.15,45.89 15.51,39.25 15.51,30.84 18.24,28.11 28.02,28.11 29.92,30.01 33.33,30.01 34.75,28.59 SV1.2

### Text on the board
tPlace: ESP32 WROOM | - | + | D
bNames: 5 V / 500 mA / SSID: WiFi Lamp / PWD: 12345678 / AP IP: 192.168.4.1 | Reset